# Altium schematic sheet Interface connector.SchDoc
size A4; CompanyName: Technische Hochschule Nürnberg Georg Simon Ohm; Organization: UltraZohm; Address1: Kesslerplatz 12; Address2: 90489 Nürnberg; Address3: GERMANY; DocumentNumber: 9; SheetNumber: 9; SheetTotal: 12; Website: www.ultrazohm.com
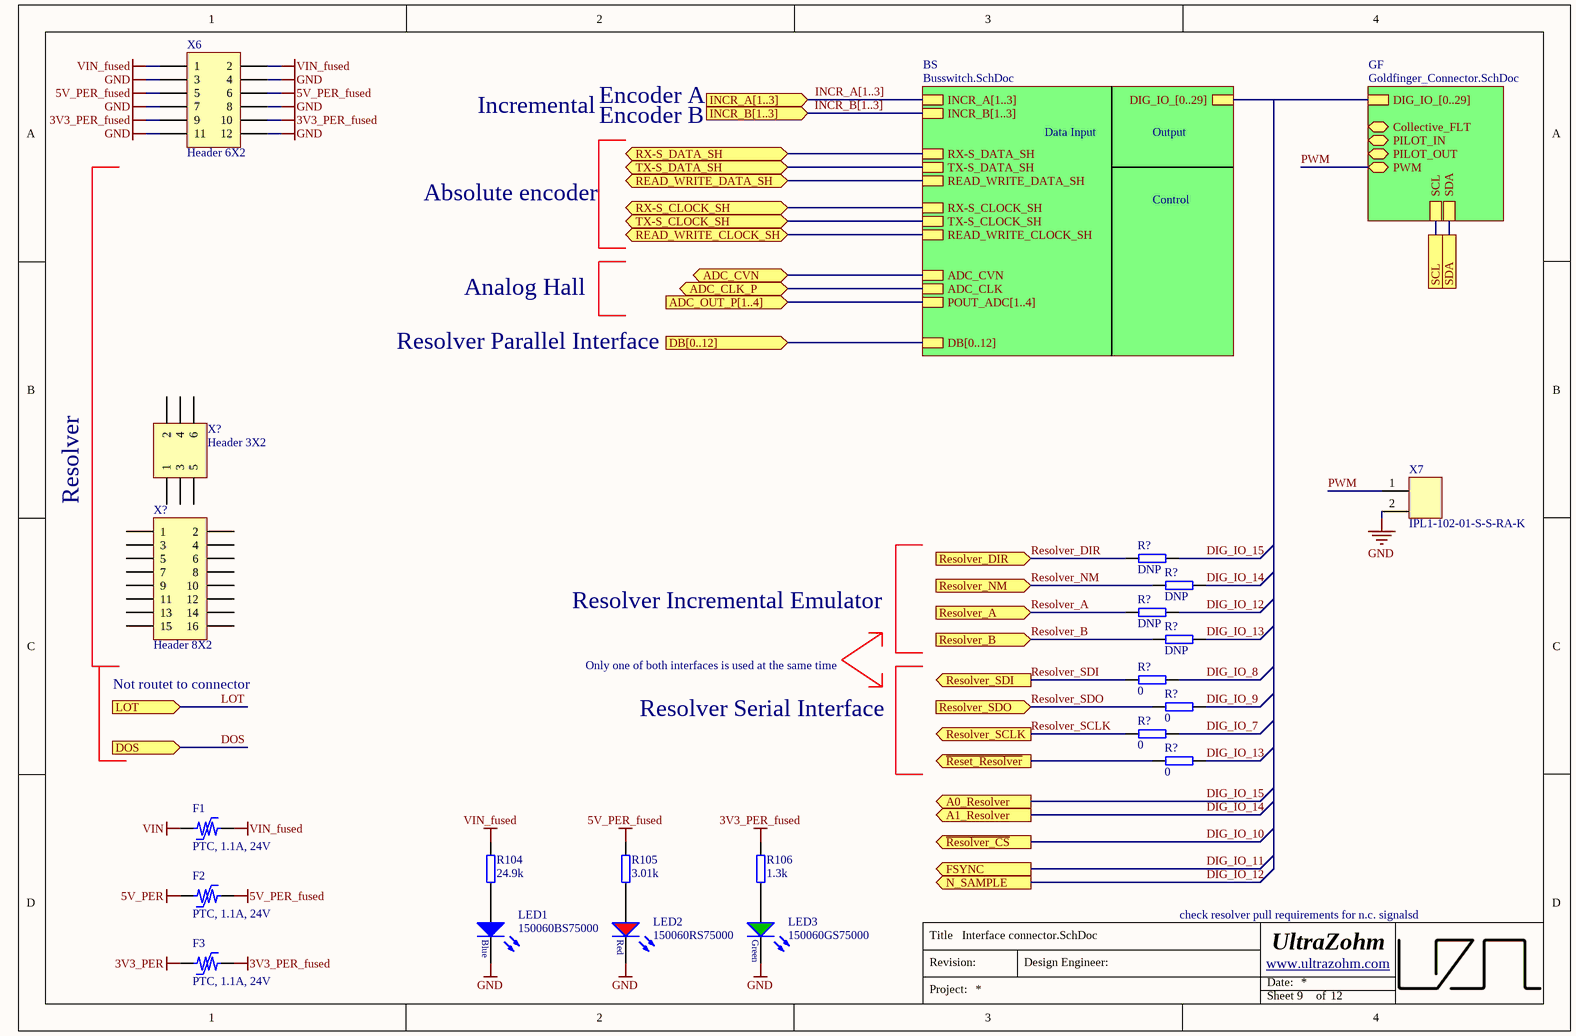
[diagram p0: Interface connector.SchDoc]

## Parts
(Parts that share a designator on the sheet are numbered #1, #2 ... from top to bottom, then left to right.)
F1  PTC, 1.1A, 24V  [1812_PTC_Polyfuse_Littelfuse]
F2  PTC, 1.1A, 24V  [1812_PTC_Polyfuse_Littelfuse]
F3  PTC, 1.1A, 24V  [1812_PTC_Polyfuse_Littelfuse]
LED1  150060BS75000  [WL-SMCW_0603]
LED2  150060RS75000  [WL-SMCW_0603]
LED3  150060GS75000  [WL-SMCW_0603]
R104  24.9k  [RESC1608X06N]
R105  3.01k  [RESC1608X06N]
R106  1.3k  [RESC1608X06N]
R?#1  DNP  [RESC1608X06N]
R?#2  DNP  [RESC1608X06N]
R?#3  DNP  [RESC1608X06N]
R?#4  DNP  [RESC1608X06N]
R?#5  0  [RESC1608X06N]
R?#6  0  [RESC1608X06N]
R?#7  0  [RESC1608X06N]
R?#8  0  [RESC1608X06N]
X6  Header 6X2  [HDR2X6]
X7  IPL1-102-01-S-S-RA-K  [Conector 1x2 TH Horizontal]
X?#1  Header 3X2  [HDR2X3]
X?#2  Header 8X2  [HDR2X8]

## Sub-sheets
BS = Busswitch.SchDoc: TX-S_DATA_SH, READ_WRITE_DATA_SH, INCR_B[1..3], POUT_ADC[1..4], ADC_CLK, RX-S_CLOCK_SH, INCR_A[1..3], RX-S_DATA_SH, ADC_CVN, TX-S_CLOCK_SH, DB[0..12], READ_WRITE_CLOCK_SH, DIG_IO_[0..29]
GF = Goldfinger_Connector.SchDoc: Collective_FLT (bidir), PILOT_IN (bidir), PILOT_OUT (bidir), PWM (bidir), DIG_IO_[0..29], SDA, SCL

## Ports
A0_Resolver (out), A1_Resolver (out), ADC_CLK_P (bidir), ADC_CVN (bidir), ADC_OUT_P[1..4] (in), DB[0..12] (in), DOS (in), FSYNC (out), INCR_A[1..3] (in), INCR_B[1..3] (in), LOT (in), N_SAMPLE (out), READ_WRITE_CLOCK_SH (bidir), READ_WRITE_DATA_SH (bidir), Resolver_A (in), Resolver_B (in), Resolver_DIR (in), Resolver_NM (in), Resolver_SCLK (out), Resolver_SDI (out), Resolver_SDO (in), RX-S_CLOCK_SH (bidir), RX-S_DATA_SH (bidir), SCL, SDA, TX-S_CLOCK_SH (bidir), TX-S_DATA_SH (bidir), ~{Reset_Resolver} (out), ~{Resolver_CS} (out)

## Nets
3V3_PER: F3.1
3V3_PER_fused: F3.2 R106.2 X6.9 X6.10
5V_PER: F2.1
5V_PER_fused: F2.2 R105.2 X6.5 X6.6
GND: LED1.1(K) LED2.1(K) LED3.1(K) X6.3 X6.4 X6.7 X6.8 X6.11 X6.12 X7.2
VIN: F1.1
VIN_fused: F1.2 R104.2 X6.1 X6.2
~{Reset_Resolver}: R?#8.2 ; port ~{Reset_Resolver}
ADC_CLK_P: port ADC_CLK_P, sheet BS/ADC_CLK
ADC_CVN: port ADC_CVN, sheet BS/ADC_CVN
DIG_IO_7: R?#7.1
DIG_IO_8: R?#5.1
DIG_IO_9: R?#6.1
DIG_IO_10: port ~{Resolver_CS}
DIG_IO_11: port FSYNC
DIG_IO_12: R?#3.1 ; port N_SAMPLE
DIG_IO_13: R?#4.1 R?#8.1
DIG_IO_14: R?#2.1 ; port A1_Resolver
DIG_IO_15: R?#1.1 ; port A0_Resolver
DOS: port DOS
LOT: port LOT
PWM: X7.1 ; sheet GF/PWM
READ_WRITE_CLOCK_SH: port READ_WRITE_CLOCK_SH, sheet BS/READ_WRITE_CLOCK_SH
READ_WRITE_DATA_SH: port READ_WRITE_DATA_SH, sheet BS/READ_WRITE_DATA_SH
Resolver_A: R?#3.2 ; port Resolver_A
Resolver_B: R?#4.2 ; port Resolver_B
Resolver_DIR: R?#1.2 ; port Resolver_DIR
Resolver_NM: R?#2.2 ; port Resolver_NM
Resolver_SCLK: R?#7.2 ; port Resolver_SCLK
Resolver_SDI: R?#5.2 ; port Resolver_SDI
Resolver_SDO: R?#6.2 ; port Resolver_SDO
RX-S_CLOCK_SH: port RX-S_CLOCK_SH, sheet BS/RX-S_CLOCK_SH
RX-S_DATA_SH: port RX-S_DATA_SH, sheet BS/RX-S_DATA_SH
SCL: port SCL, sheet GF/SCL
SDA: port SDA, sheet GF/SDA
TX-S_CLOCK_SH: port TX-S_CLOCK_SH, sheet BS/TX-S_CLOCK_SH
TX-S_DATA_SH: port TX-S_DATA_SH, sheet BS/TX-S_DATA_SH
NetLED1_2: LED1.2(A) R104.1
NetLED2_2: LED2.2(A) R105.1
NetLED3_2: LED3.2(A) R106.1

Not connected (* = marked no-connect by the designer): X?#1 1 2 3 4 5 6; X?#2 1 2 3 4 5 6 7 8 9 10 11 12 13 14 15 16

## Buses and harness runs
bus INCR_A[1..3] = port INCR_A[1..3] = sheet BS/INCR_A[1..3]
bus INCR_B[1..3] = port INCR_B[1..3] = sheet BS/INCR_B[1..3]
bus port ADC_OUT_P[1..4] = sheet BS/POUT_ADC[1..4]
bus port DB[0..12] = sheet BS/DB[0..12]
bus sheet BS/DIG_IO_[0..29] = sheet GF/DIG_IO_[0..29]

## Notes on the sheet
- Incremental
- Encoder A
- Encoder B
- Data Input
- Output
- Absolute encoder
- Control
- Analog Hall
- Resolver Parallel Interface
- Resolver
- Resolver Incremental Emulator
- (near X?#2) Not routet to connector
- Only one of both interfaces is used at the same time
- Resolver Serial Interface
- check resolver pull requirements for n.c. signalsd
- Title
- Revision:
- Design Engineer:
- Date:
- Project:
- Sheet
- of

## Library data of the parts
F1-F3 = Littelfuse_PTC_1812: Resettable PTC Polyfuse SMD, 1812, automotive; MPN: miniASMDC110F/24; Trip Current: 2.2A; Resistance: 0.18Ohm; MF: Littelfuse; Created: 2019_02_10_AGeiger; Package: 1812; ComponentLink1URL: https://www.littelfuse.com/~/media/electronics/datasheets/resettable_ptcs/littelfuse_ptc_surface_mount_catalog_datasheet.pdf.pdf; ComponentLink1Description: Datasheet; Value: PTC, 1.1A, 24V; Voltage: 24V; Hold Current: 1.1A
LED1 = LED_Blue_0603: WL-SMCW SMD Mono-color Chip LED Waterclear, size 0603, Blue, 3.2 V, 140°; Forward Voltage: 3.2 V; Luminous Intensity: 145 mcd; Peak Wavelength: 465 nm; Dominant Wavelength: 470 nm; MF: Wuerth Elektronik; Published Date: Sep. 2017; ComponentLink1Description: Manufacturer; ComponentLink1URL: http://www.we-online.de; ComponentLink2Description: Datasheet; ComponentLink2URL: http://katalog.we-online.com/led/datasheet/150060BS75000.pdf; MPN: 150060BS75000; Size: 0603; Viewing Angle: 140°; Emitting Color: Blue; Value: 150060BS75000; Package: 0603; Created: 2018_09_06_AGeiger; Supplier 1: Farnell; Supplier Part Number 1: 2322069; Supplier 2: Mouser; Supplier Part Number 2: 710-150060BS75000; Supplier 3: Digi-Key; Supplier Part Number 3: 732-4966-1-ND
LED2 = LED_Red_0603: WL-SMCW SMD Mono-color Chip LED Waterclear, size 0603, Red, 2 V, 140°; Forward Voltage: 2 V; Luminous Intensity: 250 mcd; Peak Wavelength: 630 nm; Dominant Wavelength: 625 nm; MF: Wuerth Elektronik; Published Date: Sep. 2017; ComponentLink1Description: Manufacturer; ComponentLink1URL: http://www.we-online.de; ComponentLink2Description: Datasheet; ComponentLink2URL: http://katalog.we-online.com/led/datasheet/150060RS75000.pdf; MPN: 150060RS75000; Size: 0603; Viewing Angle: 140°; Emitting Color: Red; Value: 150060RS75000; Package: 0603; Created: 2018_09_06_AGeiger; Supplier 1: Farnell; Supplier Part Number 1: 2322071; Supplier 2: Mouser; Supplier Part Number 2: 710-150060RS75000; Supplier 3: Digi-Key; Supplier Part Number 3: 732-4978-1-ND
LED3 = LED_Green_0603: WL-SMCW SMD Mono-color Chip LED Waterclear, size 0603, Green, 3.2 V, 140°; Forward Voltage: 3.2 V; Luminous Intensity: 430 mcd; Peak Wavelength: 515 nm; Dominant Wavelength: 520 nm; MF: Wuerth Elektronik; Published Date: Sep. 2017; ComponentLink1Description: Manufacturer; ComponentLink1URL: http://www.we-online.de; ComponentLink2Description: Datasheet; ComponentLink2URL: http://katalog.we-online.com/led/datasheet/150060GS75000.pdf; MPN: 150060GS75000; Size: 0603; Viewing Angle: 140°; Emitting Color: Green; Value: 150060GS75000; Package: 0603; Created: 2018_09_06_AGeiger; Supplier 1: Farnell; Supplier Part Number 1: 2322070; Supplier 2: Mouser; Supplier Part Number 2: 710-150060GS75000; Supplier 3: Digi-Key; Supplier Part Number 3: 732-4971-1-ND
R104-R106 R?#1-R?#8 = R_0603: MPN: CRCW060324K9FKEAC; MF: Vishay / Dale; Supplier 1: Mouser; Supplier Part Number 1: 71-CRCW060324K9FKEAC; Package: 0603
  R104: Value: 24.9k
  R105: Value: 3.01k
  R106: Value: 1.3k
  R?#1-R?#4: Value: DNP
  R?#5-R?#8: Value: 0
X6 = Header 6X2: Header, 6-Pin, Dual row; LatestRevisionDate: 17-Jul-2002; LatestRevisionNote: Re-released for DXP Platform.; Publisher: Altium Limited
X7 = Conector 1x2 Horizontal: CONN HEADER R/A 2POS 2.54MM Through Hole; MF: Samtec; Supplier Part Number 2: SAM12667-ND; MPN: IPL1-102-01-S-S-RA-K; Supplier Part Number 1: 200-IPL110201SSRAK; Supplier 1: Mouser; Supplier 2: Digi-Key
X?#1 = Header 3X2: Header, 3-Pin, Dual row; LatestRevisionDate: 17-Jul-2002; LatestRevisionNote: Re-released for DXP Platform.; Publisher: Altium Limited
X?#2 = Header 8X2: Header, 8-Pin, Dual row; LatestRevisionDate: 17-Jul-2002; LatestRevisionNote: Re-released for DXP Platform.; Publisher: Altium Limited